# Altium schematic sheet buck_converter15A-5V.schdoc
size 515 x 121 mm; SheetNumber: 4; SheetTotal: 5
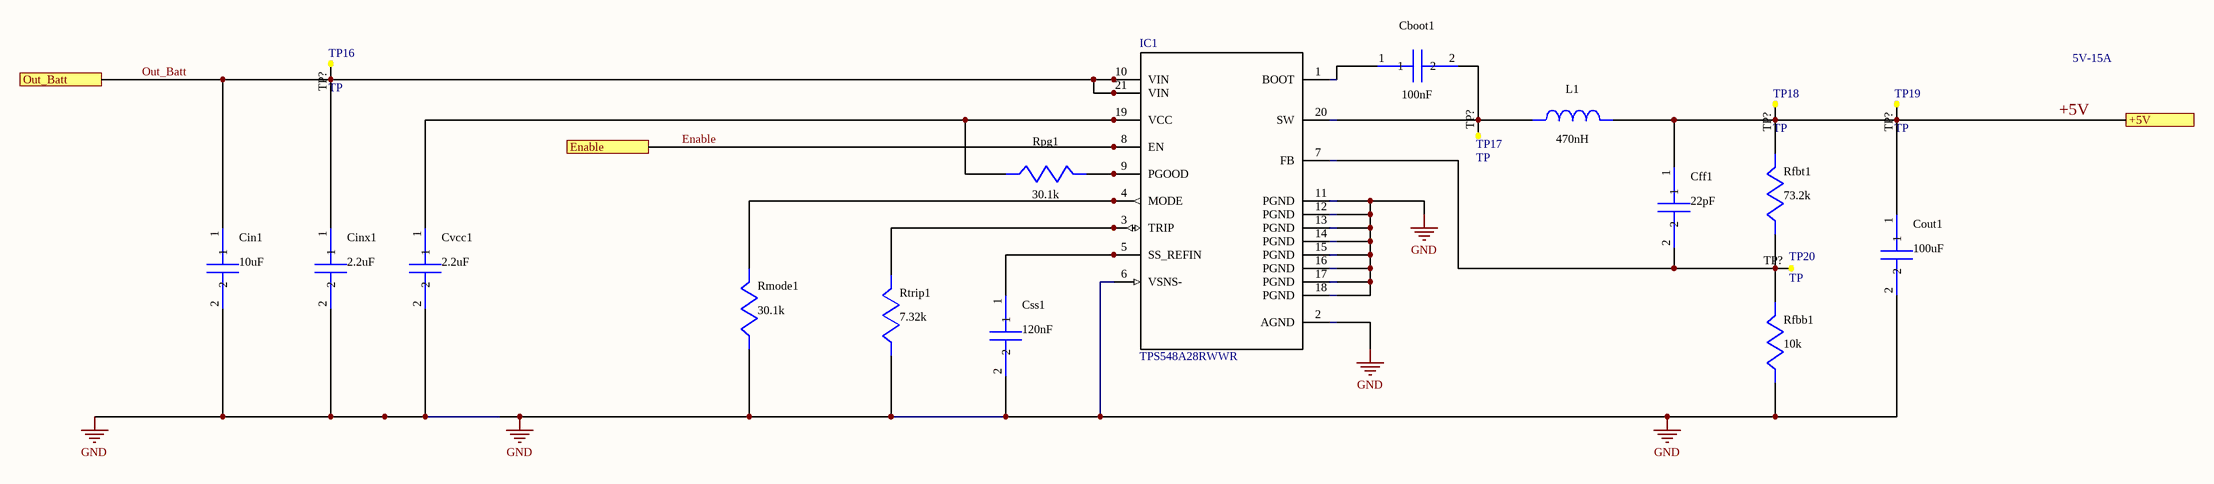
[diagram p0: buck_converter15A-5V.schdoc]

## Parts
Cboot1  value 100nF  [CAPC1005X55N]  (hidden comment: EMK105 B7104KVHF)
Cff1  C1005C0G1H220J: 22pF  [CAPC1005X55N]  (hidden comment: C1005C0G1H220J)
Cin1  value 10uF  [CAPC3216X200N]  (hidden comment: GCJ31CC71E106K)
Cinx1  value 2.2uF  [CAPC1608X80N]  (hidden comment: GCM188C71A225K)
Cout1  value 100uF  [CAPC3225X270N]  (hidden comment: EMK325ABJ107MM-T)
Css1  value 120nF  [CAPC1005X55N]  (hidden comment: C1608X7R1H154K)
Cvcc1  value 2.2uF  [CAPC1608X80N]  (hidden comment: GCM188C71A225K)
IC1  TPS548A28RWWR  [RWW0021A]
L1  value 470nH  [IHLP4040DZERR47M11]  (hidden comment: IHLP4040DZERR47M11)
Rfbb1  value 10k  [SMM02040D1501BB300]  (hidden comment: SMM0204 50 10K 1 %)
Rfbt1  value 73.2k  [ERJ2RKD1004X]  (hidden comment: SMM0204 50 73K2 1 %)
Rmode1  value 30.1k  [SMM02040D1501BB300]  (hidden comment: SMM0204 50 30K1 1 %)
Rpg1  value 30.1k  [SMM02040D1501BB300]  (hidden comment: SMM0204 50 30K1 1 %)
Rtrip1  value 7.32k  [ERJ2RKD1004X]  (hidden comment: SMM0204 50 7K32 1 %)
TP16  TP  [Test_Point0.5x0.5]
TP17  TP  [Test_Point0.5x0.5]
TP18  TP  [Test_Point0.5x0.5]
TP19  TP  [Test_Point0.5x0.5]
TP20  TP  [Test_Point0.5x0.5]

## Ports
+5V, Enable, Out_Batt

## Nets
GND: Cin1.2 Cinx1.2 Cout1.2 Css1.2 Cvcc1.2 IC1.2(AGND) IC1.6(VSNS-) IC1.11(PGND) IC1.12(PGND) IC1.13(PGND) IC1.14(PGND) IC1.15(PGND) IC1.16(PGND) IC1.17(PGND) IC1.18(PGND) Rfbb1.2 Rmode1.2 Rtrip1.2
+5V: Cff1.1 Cout1.1 L1.1 Rfbt1.1 TP18.TP?(TP) TP19.TP?(TP) ; port +5V
Enable: IC1.8(EN) ; port Enable
Out_Batt: Cin1.1 Cinx1.1 IC1.10(VIN) IC1.21(VIN) TP16.TP?(TP) ; port Out_Batt
NetCboot1_1: Cboot1.1 IC1.1(BOOT)
NetCboot1_2: Cboot1.2 IC1.20(SW) L1.2 TP17.TP?(TP)
NetCff1_2: Cff1.2 IC1.7(FB) Rfbb1.1 Rfbt1.2 TP20.TP?(TP)
NetCss1_1: Css1.1 IC1.5(SS_REFIN)
NetCvcc1_1: Cvcc1.1 IC1.19(VCC) Rpg1.2
NetIC1_3: IC1.3(TRIP) Rtrip1.1
NetIC1_4: IC1.4(MODE) Rmode1.1
NetIC1_9: IC1.9(PGOOD) Rpg1.1

## Notes on the sheet
- 5V-15A

## Library data of the parts
Cboot1 = EMK107B7104KA-T: Manufacturer Name: Taiyo Yuden; PackageReference: EMK107B7104KA-T; Manufacturer Part Number: EMK107B7104KA-T
Cff1 = C0402C240J3GACTU: Manufacturer Name: Kemet; PackageReference: C0402C240J3GACTU; Manufacturer Part Number: C0402C240J3GACTU
Cin1 = GRM31CR71E106KA12L: GRM31CR71E106KA1; Manufacturer Name: MuRata; PackageReference: GRM31CR71E106KA12L; Manufacturer Part Number: GRM31CR71E106KA12L
Cinx1 = C1608X7R1A225K080AC: C1608X7R1A225K08; Manufacturer Name: TDK; PackageReference: C1608X7R1A225K080AC; Manufacturer Part Number: C1608X7R1A225K080AC
Cout1 = GENERIC_CAPACITOR: CUSTOM1; Manufacturer Name: CUSTOM; PackageReference: CUSTOM; Manufacturer Part Number: GENERIC_CAPACITOR
Css1 = GRM155R61A124KE19D: GRM155R61A124KE1; Manufacturer Name: MuRata; PackageReference: GRM155R61A124KE19D; Manufacturer Part Number: GRM155R61A124KE19D
Cvcc1 = GRM188R71A225KE15D: GRM188R71A225KE1; Manufacturer Name: MuRata; PackageReference: GRM188R71A225KE15D; Manufacturer Part Number: GRM188R71A225KE15D
IC1 = TPS548A28RWWR: No Description Available; Manufacturer: Texas Instruments; PartNumber: TPS548A28RWWR; RefDes: RefDes; TYPE: TYPE; Value: Value; Manufacturer_Part_Number: TPS548A28RWWR; Manufacturer_Name: Texas Instruments; Copyright: Copyright (C) 2018 Accelerated Designs. All rights reserved
L1 = IHLP4040DZERR47M11: IHLP4040DZERR47M; Manufacturer Name: Vishay-Dale; PackageReference: IHLP4040DZERR47M11; Manufacturer Part Number: IHLP4040DZERR47M11
Rfbb1 = CRCW040210K0FKED: Manufacturer Name: Vishay-Dale; PackageReference: CRCW040210K0FKED; Manufacturer Part Number: CRCW040210K0FKED
Rfbt1 = CRCW040273K2FKED: Manufacturer Name: Vishay-Dale; PackageReference: CRCW040273K2FKED; Manufacturer Part Number: CRCW040273K2FKED
Rmode1 Rpg1 = CRCW040230K1FKED: Manufacturer Name: Vishay-Dale; PackageReference: CRCW040230K1FKED; Manufacturer Part Number: CRCW040230K1FKED
Rtrip1 = CRCW04027K32FKED: Manufacturer Name: Vishay-Dale; PackageReference: CRCW04027K32FKED; Manufacturer Part Number: CRCW04027K32FKED
TP16-TP20 = TEst_Point_0.5x0.5